# Altium project stm32f103cb_hm.PrjPcb (part 2 of 2)
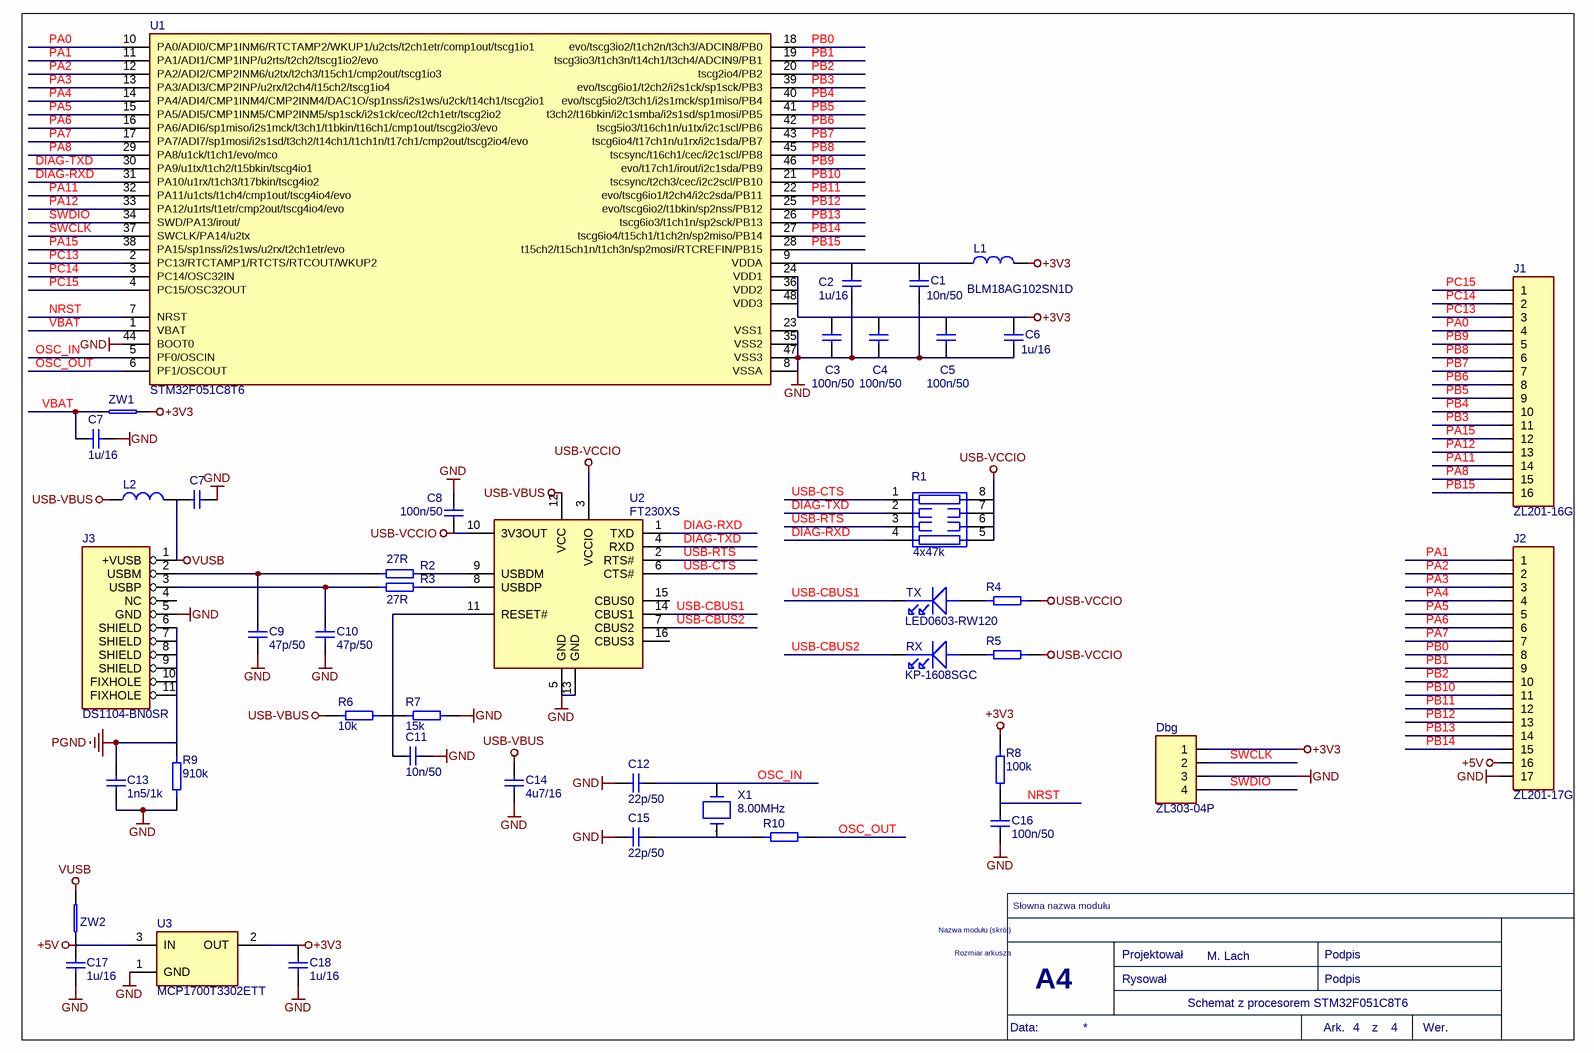
[diagram p4: stm32f103cb_hm_F051.SchDoc]

## Nets that join several sheets
+3V3: stm32f103cb_hm_main (13 pins), stm32f103cb_hm_F100 (13 pins), stm32f103cb_hm_L073 (13 pins), stm32f103cb_hm_F051 (13 pins)
+5V: stm32f103cb_hm_main (C18#1.1 J2#1.16 U3#1.3 ZW2#1.1), stm32f103cb_hm_F100 (C17#2.1 J2#2.16 U3#2.3 ZW2#2.1), stm32f103cb_hm_L073 (C17#3.1 J2#3.16 U3#3.3 ZW2#3.1), stm32f103cb_hm_F051 (C17#4.1 J2#4.16 U3#4.3 ZW2#4.1)
GND: stm32f103cb_hm_main (32 pins), stm32f103cb_hm_F100 (31 pins), stm32f103cb_hm_L073 (32 pins), stm32f103cb_hm_F051 (32 pins)
PGND: stm32f103cb_hm_main (6 pins), stm32f103cb_hm_F100 (8 pins), stm32f103cb_hm_L073 (8 pins), stm32f103cb_hm_F051 (8 pins)
USB-VBUS: stm32f103cb_hm_main (C15#1.1 L2#1.2 R6#1.1 U2#1.12), stm32f103cb_hm_F100 (C14#2.1 L2#2.2 R6#2.1 U2#2.12), stm32f103cb_hm_L073 (C14#3.1 L2#3.2 R6#3.1 U2#3.12), stm32f103cb_hm_F051 (C14#4.1 L2#4.2 R6#4.1 U2#4.12)
USB-VCCIO: stm32f103cb_hm_main (9 pins), stm32f103cb_hm_F100 (9 pins), stm32f103cb_hm_L073 (9 pins), stm32f103cb_hm_F051 (9 pins)
VUSB: stm32f103cb_hm_main (C8#1.2 L2#1.1 RS232USB.1 ZW2#1.2), stm32f103cb_hm_F100 (C7#2.2 J3#1.1 L2#2.1 ZW2#2.2), stm32f103cb_hm_L073 (C7#4.2 J3#2.1 L2#3.1 ZW2#3.2), stm32f103cb_hm_F051 (C7#6.2 J3#3.1 L2#4.1 ZW2#4.2)
DIAG-RXD: stm32f103cb_hm_main (R1#1.4 U1#1.31 U2#1.1), stm32f103cb_hm_F100 (R1#2.4 U1#2.31 U2#2.1), stm32f103cb_hm_L073 (R1#3.4 U1#3.31 U2#3.1), stm32f103cb_hm_F051 (R1#4.4 U1#4.31 U2#4.1)
DIAG-TXD: stm32f103cb_hm_main (R1#1.2 U1#1.30 U2#1.4), stm32f103cb_hm_F100 (R1#2.2 U1#2.30 U2#2.4), stm32f103cb_hm_L073 (R1#3.2 U1#3.30 U2#3.4), stm32f103cb_hm_F051 (R1#4.2 U1#4.30 U2#4.4)
NRST: stm32f103cb_hm_main (C17#1.1 R8#1.2 U1#1.7), stm32f103cb_hm_F100 (C16#2.1 R8#2.2 U1#2.7), stm32f103cb_hm_L073 (C16#3.1 R8#3.2 U1#3.7), stm32f103cb_hm_F051 (C16#4.1 R8#4.2 U1#4.7)
OSC_IN: stm32f103cb_hm_main (C13#1.2 U1#1.5 X1#1.1), stm32f103cb_hm_F100 (C12#2.2 U1#2.5 X1#2.1), stm32f103cb_hm_L073 (C12#3.2 U1#3.5 X1#3.1), stm32f103cb_hm_F051 (C12#4.2 U1#4.5 X1#4.1)
OSC_OUT: stm32f103cb_hm_main (R10#1.2 U1#1.6), stm32f103cb_hm_F100 (R10#2.2 U1#2.6), stm32f103cb_hm_L073 (R10#3.2 U1#3.6), stm32f103cb_hm_F051 (R10#4.2 U1#4.6)
PA0: stm32f103cb_hm_main (J1#1.5 U1#1.10), stm32f103cb_hm_F100 (J1#2.4 U1#2.10), stm32f103cb_hm_L073 (J1#3.4 U1#3.10), stm32f103cb_hm_F051 (J1#4.4 U1#4.10)
PA1: stm32f103cb_hm_main (J2#1.1 U1#1.11), stm32f103cb_hm_F100 (J2#2.1 U1#2.11), stm32f103cb_hm_L073 (J2#3.1 U1#3.11), stm32f103cb_hm_F051 (J2#4.1 U1#4.11)
PA2: stm32f103cb_hm_main (J2#1.2 U1#1.12), stm32f103cb_hm_F100 (J2#2.2 U1#2.12), stm32f103cb_hm_L073 (J2#3.2 U1#3.12), stm32f103cb_hm_F051 (J2#4.2 U1#4.12)
PA3: stm32f103cb_hm_main (J2#1.3 U1#1.13), stm32f103cb_hm_F100 (J2#2.3 U1#2.13), stm32f103cb_hm_L073 (J2#3.3 U1#3.13), stm32f103cb_hm_F051 (J2#4.3 U1#4.13)
PA4: stm32f103cb_hm_main (J2#1.4 U1#1.14), stm32f103cb_hm_F100 (J2#2.4 U1#2.14), stm32f103cb_hm_L073 (J2#3.4 U1#3.14), stm32f103cb_hm_F051 (J2#4.4 U1#4.14)
PA5: stm32f103cb_hm_main (J2#1.5 U1#1.15), stm32f103cb_hm_F100 (J2#2.5 U1#2.15), stm32f103cb_hm_L073 (J2#3.5 U1#3.15), stm32f103cb_hm_F051 (J2#4.5 U1#4.15)
PA6: stm32f103cb_hm_main (J2#1.6 U1#1.16), stm32f103cb_hm_F100 (J2#2.6 U1#2.16), stm32f103cb_hm_L073 (J2#3.6 U1#3.16), stm32f103cb_hm_F051 (J2#4.6 U1#4.16)
PA7: stm32f103cb_hm_main (J2#1.7 U1#1.17), stm32f103cb_hm_F100 (J2#2.7 U1#2.17), stm32f103cb_hm_L073 (J2#3.7 U1#3.17), stm32f103cb_hm_F051 (J2#4.7 U1#4.17)
PA8: stm32f103cb_hm_main (J1#1.16 U1#1.29), stm32f103cb_hm_F100 (J1#2.15 U1#2.29), stm32f103cb_hm_L073 (J1#3.15 U1#3.29), stm32f103cb_hm_F051 (J1#4.15 U1#4.29)
PA11: stm32f103cb_hm_main (J1#1.15 U1#1.32), stm32f103cb_hm_F100 (J1#2.14 U1#2.32), stm32f103cb_hm_L073 (J1#3.14 U1#3.32), stm32f103cb_hm_F051 (J1#4.14 U1#4.32)
PA12: stm32f103cb_hm_main (J1#1.14 U1#1.33), stm32f103cb_hm_F100 (J1#2.13 U1#2.33), stm32f103cb_hm_L073 (J1#3.13 U1#3.33), stm32f103cb_hm_F051 (J1#4.13 U1#4.33)
PA15: stm32f103cb_hm_main (J1#1.13 U1#1.38), stm32f103cb_hm_F100 (J1#2.12 U1#2.38), stm32f103cb_hm_L073 (J1#3.12 U1#3.38), stm32f103cb_hm_F051 (J1#4.12 U1#4.38)
PB0: stm32f103cb_hm_main (J2#1.8 U1#1.18), stm32f103cb_hm_F100 (J2#2.8 U1#2.18), stm32f103cb_hm_L073 (J2#3.8 U1#3.18), stm32f103cb_hm_F051 (J2#4.8 U1#4.18)
PB1: stm32f103cb_hm_main (J2#1.9 U1#1.19), stm32f103cb_hm_F100 (J2#2.9 U1#2.19), stm32f103cb_hm_L073 (J2#3.9 U1#3.19), stm32f103cb_hm_F051 (J2#4.9 U1#4.19)
PB2: stm32f103cb_hm_main (J2#1.10 U1#1.20), stm32f103cb_hm_F100 (J2#2.10 U1#2.20), stm32f103cb_hm_L073 (J2#3.10 U1#3.20), stm32f103cb_hm_F051 (J2#4.10 U1#4.20)
PB3: stm32f103cb_hm_main (J1#1.12 U1#1.39), stm32f103cb_hm_F100 (J1#2.11 U1#2.39), stm32f103cb_hm_L073 (J1#3.11 U1#3.39), stm32f103cb_hm_F051 (J1#4.11 U1#4.39)
PB4: stm32f103cb_hm_main (J1#1.11 U1#1.40), stm32f103cb_hm_F100 (J1#2.10 U1#2.40), stm32f103cb_hm_L073 (J1#3.10 U1#3.40), stm32f103cb_hm_F051 (J1#4.10 U1#4.40)
PB5: stm32f103cb_hm_main (J1#1.10 U1#1.41), stm32f103cb_hm_F100 (J1#2.9 U1#2.41), stm32f103cb_hm_L073 (J1#3.9 U1#3.41), stm32f103cb_hm_F051 (J1#4.9 U1#4.41)
PB6: stm32f103cb_hm_main (J1#1.9 U1#1.42), stm32f103cb_hm_F100 (J1#2.8 U1#2.42), stm32f103cb_hm_L073 (J1#3.8 U1#3.42), stm32f103cb_hm_F051 (J1#4.8 U1#4.42)
PB7: stm32f103cb_hm_main (J1#1.8 U1#1.43), stm32f103cb_hm_F100 (J1#2.7 U1#2.43), stm32f103cb_hm_L073 (J1#3.7 U1#3.43), stm32f103cb_hm_F051 (J1#4.7 U1#4.43)
PB8: stm32f103cb_hm_main (J1#1.7 U1#1.45), stm32f103cb_hm_F100 (J1#2.6 U1#2.45), stm32f103cb_hm_L073 (J1#3.6 U1#3.45), stm32f103cb_hm_F051 (J1#4.6 U1#4.45)
PB9: stm32f103cb_hm_main (J1#1.6 U1#1.46), stm32f103cb_hm_F100 (J1#2.5 U1#2.46), stm32f103cb_hm_L073 (J1#3.5 U1#3.46), stm32f103cb_hm_F051 (J1#4.5 U1#4.46)
PB10: stm32f103cb_hm_main (J2#1.11 U1#1.21), stm32f103cb_hm_F100 (J2#2.11 U1#2.21), stm32f103cb_hm_L073 (J2#3.11 U1#3.21), stm32f103cb_hm_F051 (J2#4.11 U1#4.21)
PB11: stm32f103cb_hm_main (J2#1.12 U1#1.22), stm32f103cb_hm_F100 (J2#2.12 U1#2.22), stm32f103cb_hm_L073 (J2#3.12 U1#3.22), stm32f103cb_hm_F051 (J2#4.12 U1#4.22)
PB12: stm32f103cb_hm_main (J2#1.13 U1#1.25), stm32f103cb_hm_F100 (J2#2.13 U1#2.25), stm32f103cb_hm_L073 (J2#3.13 U1#3.25), stm32f103cb_hm_F051 (J2#4.13 U1#4.25)
PB13: stm32f103cb_hm_main (J2#1.14 U1#1.26), stm32f103cb_hm_F100 (J2#2.14 U1#2.26), stm32f103cb_hm_L073 (J2#3.14 U1#3.26), stm32f103cb_hm_F051 (J2#4.14 U1#4.26)
PB14: stm32f103cb_hm_main (J2#1.15 U1#1.27), stm32f103cb_hm_F100 (J2#2.15 U1#2.27), stm32f103cb_hm_L073 (J2#3.15 U1#3.27), stm32f103cb_hm_F051 (J2#4.15 U1#4.27)
PB15: stm32f103cb_hm_main (J1#1.17 U1#1.28), stm32f103cb_hm_F100 (J1#2.16 U1#2.28), stm32f103cb_hm_L073 (J1#3.16 U1#3.28), stm32f103cb_hm_F051 (J1#4.16 U1#4.28)
PC13: stm32f103cb_hm_main (J1#1.3 U1#1.2), stm32f103cb_hm_F100 (J1#2.3 U1#2.2), stm32f103cb_hm_L073 (J1#3.3 U1#3.2), stm32f103cb_hm_F051 (J1#4.3 U1#4.2)
PC14: stm32f103cb_hm_main (J1#1.2 U1#1.3), stm32f103cb_hm_F100 (J1#2.2 U1#2.3), stm32f103cb_hm_L073 (J1#3.2 U1#3.3), stm32f103cb_hm_F051 (J1#4.2 U1#4.3)
PC15: stm32f103cb_hm_main (J1#1.1 U1#1.4), stm32f103cb_hm_F100 (J1#2.1 U1#2.4), stm32f103cb_hm_L073 (J1#3.1 U1#3.4), stm32f103cb_hm_F051 (J1#4.1 U1#4.4)
SWCLK: stm32f103cb_hm_main (Dbg#1.2 U1#1.37), stm32f103cb_hm_F100 (Dbg#2.2 U1#2.37), stm32f103cb_hm_L073 (Dbg#3.2 U1#3.37), stm32f103cb_hm_F051 (Dbg#4.2 U1#4.37)
SWDIO: stm32f103cb_hm_main (Dbg#1.4 U1#1.34), stm32f103cb_hm_F100 (Dbg#2.4 U1#2.34), stm32f103cb_hm_L073 (Dbg#3.4 U1#3.34), stm32f103cb_hm_F051 (Dbg#4.4 U1#4.34)
USB-CBUS1: stm32f103cb_hm_main (TX#1.CATH U2#1.14), stm32f103cb_hm_F100 (TX#2.CATH U2#2.14), stm32f103cb_hm_L073 (TX#3.CATH U2#3.14), stm32f103cb_hm_F051 (TX#4.CATH U2#4.14)
USB-CBUS2: stm32f103cb_hm_main (RX#1.CATH U2#1.7), stm32f103cb_hm_F100 (RX#2.CATH U2#2.7), stm32f103cb_hm_L073 (RX#3.CATH U2#3.7), stm32f103cb_hm_F051 (RX#4.CATH U2#4.7)
USB-CTS: stm32f103cb_hm_main (R1#1.1 U2#1.6), stm32f103cb_hm_F100 (R1#2.1 U2#2.6), stm32f103cb_hm_L073 (R1#3.1 U2#3.6), stm32f103cb_hm_F051 (R1#4.1 U2#4.6)
USB-RTS: stm32f103cb_hm_main (R1#1.3 U2#1.2), stm32f103cb_hm_F100 (R1#2.3 U2#2.2), stm32f103cb_hm_L073 (R1#3.3 U2#3.2), stm32f103cb_hm_F051 (R1#4.3 U2#4.2)
VBAT: stm32f103cb_hm_main (C7#1.1 J1#1.4 U1#1.1 ZW1#1.1), stm32f103cb_hm_F100 (U1#2.1 ZW1#2.1), stm32f103cb_hm_L073 (C7#3.1 U1#3.1 ZW1#3.1), stm32f103cb_hm_F051 (C7#5.1 U1#4.1 ZW1#4.1)